# EAGLE design Cyberdeck Mech Keeb (EAGLE 7.7.0)
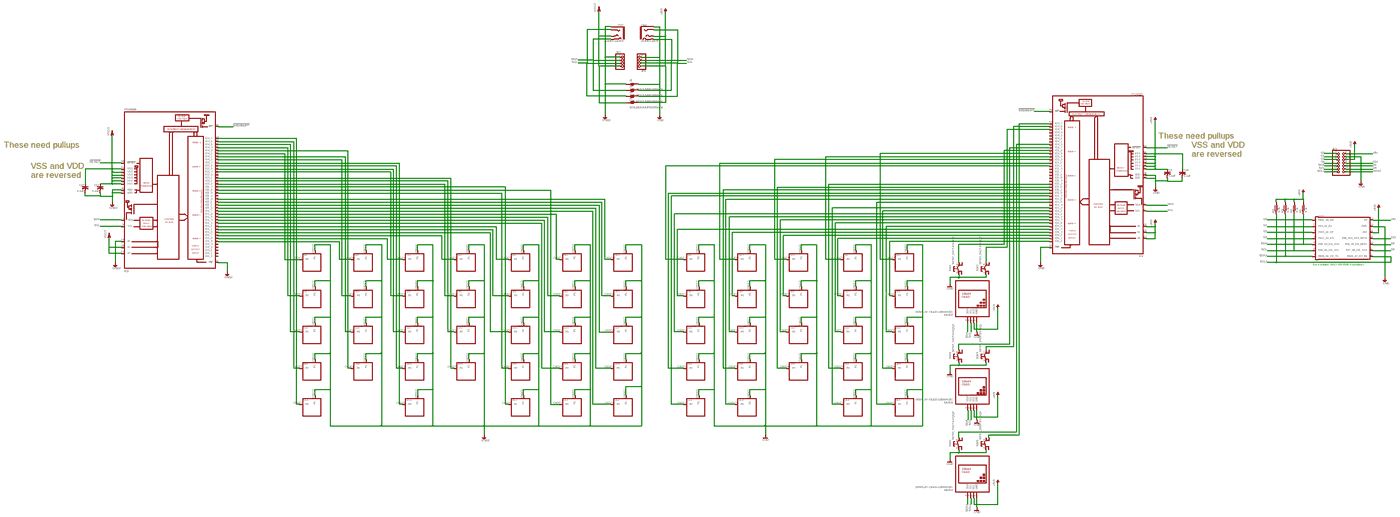
[diagram p0: schematic, sheet 1, overview]
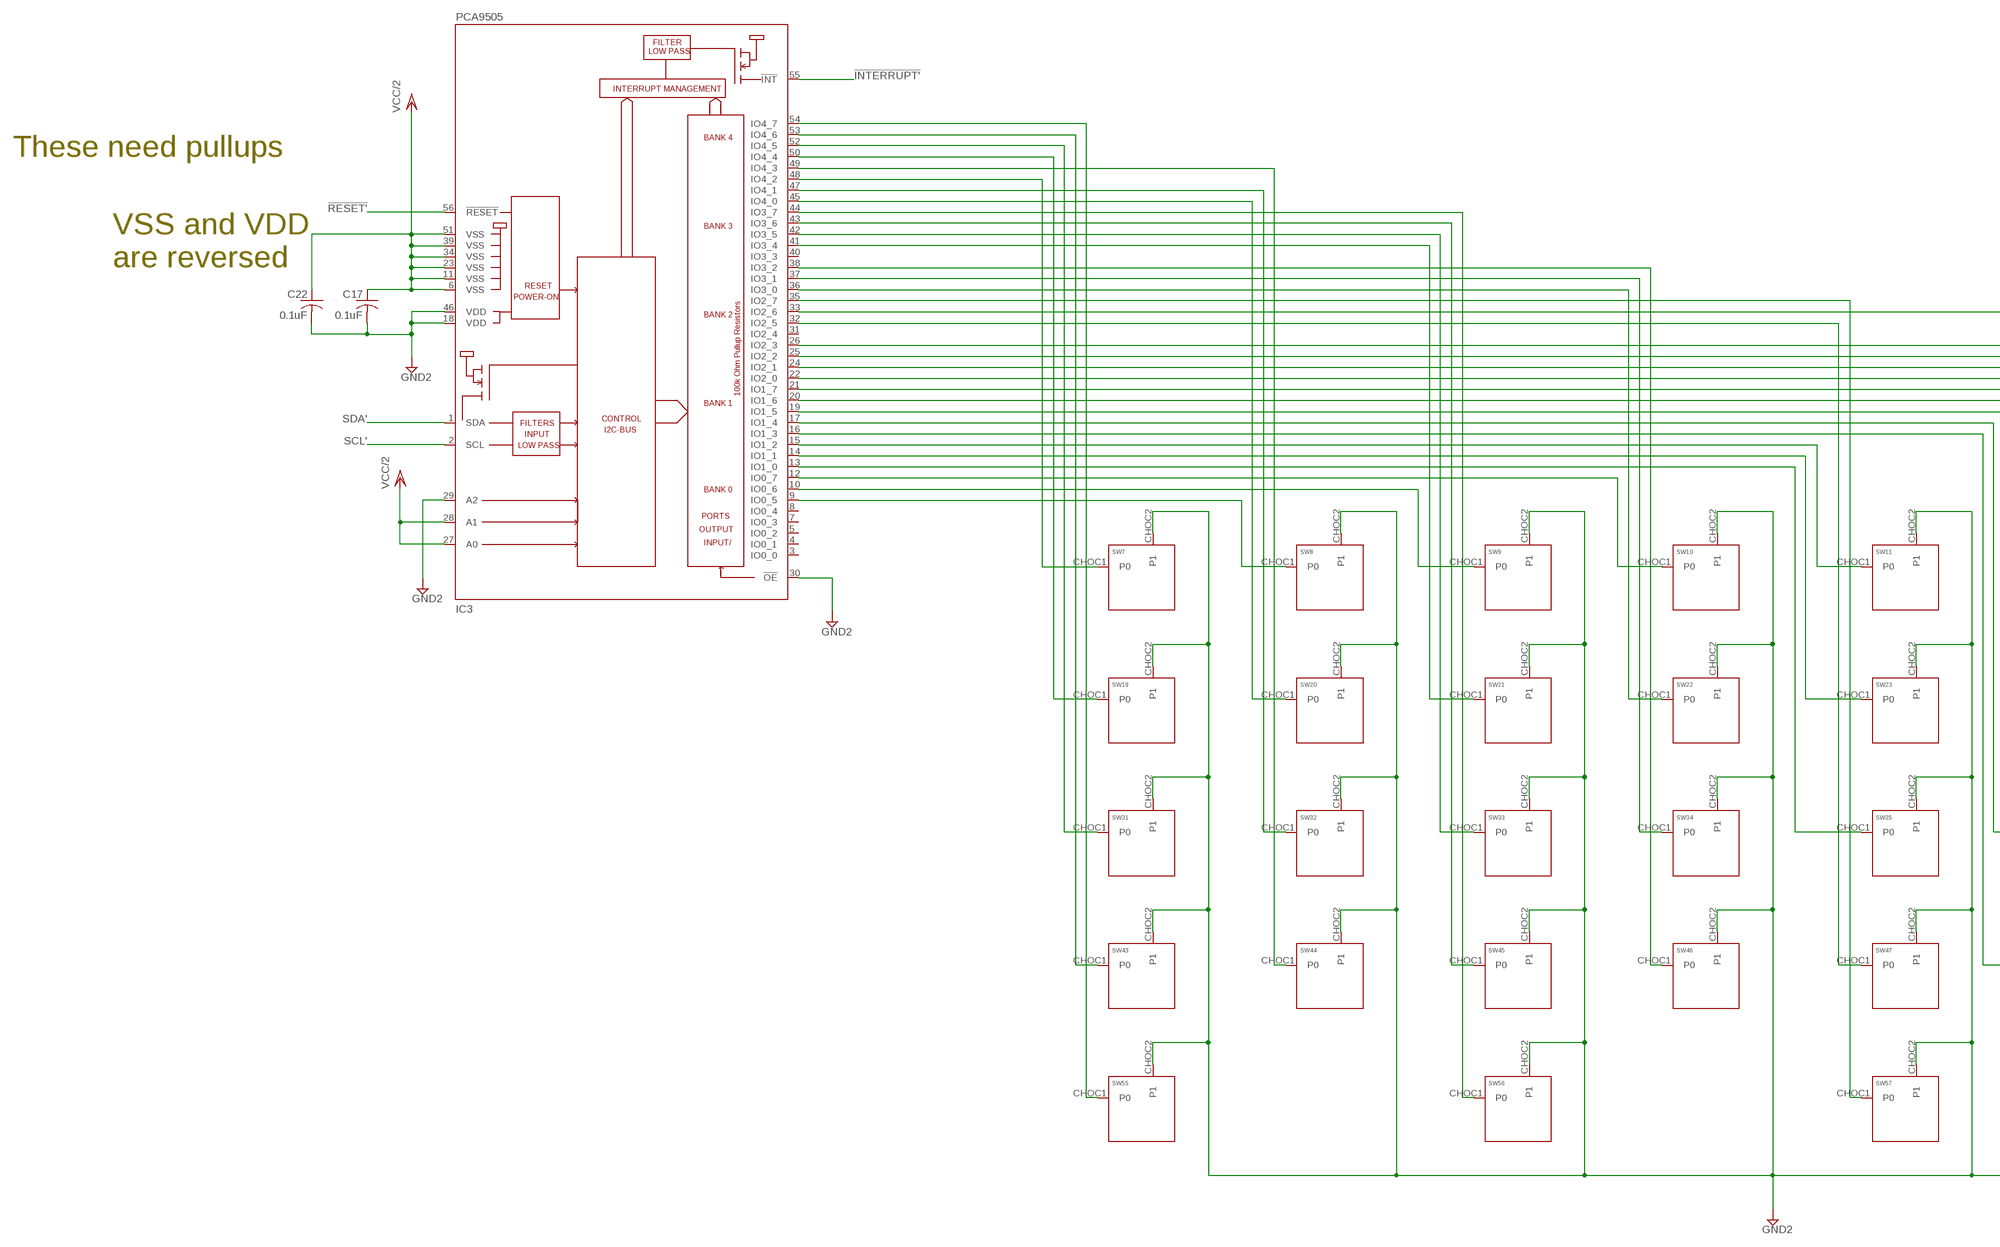
[diagram p1: schematic, sheet 1, part 1 of 4]
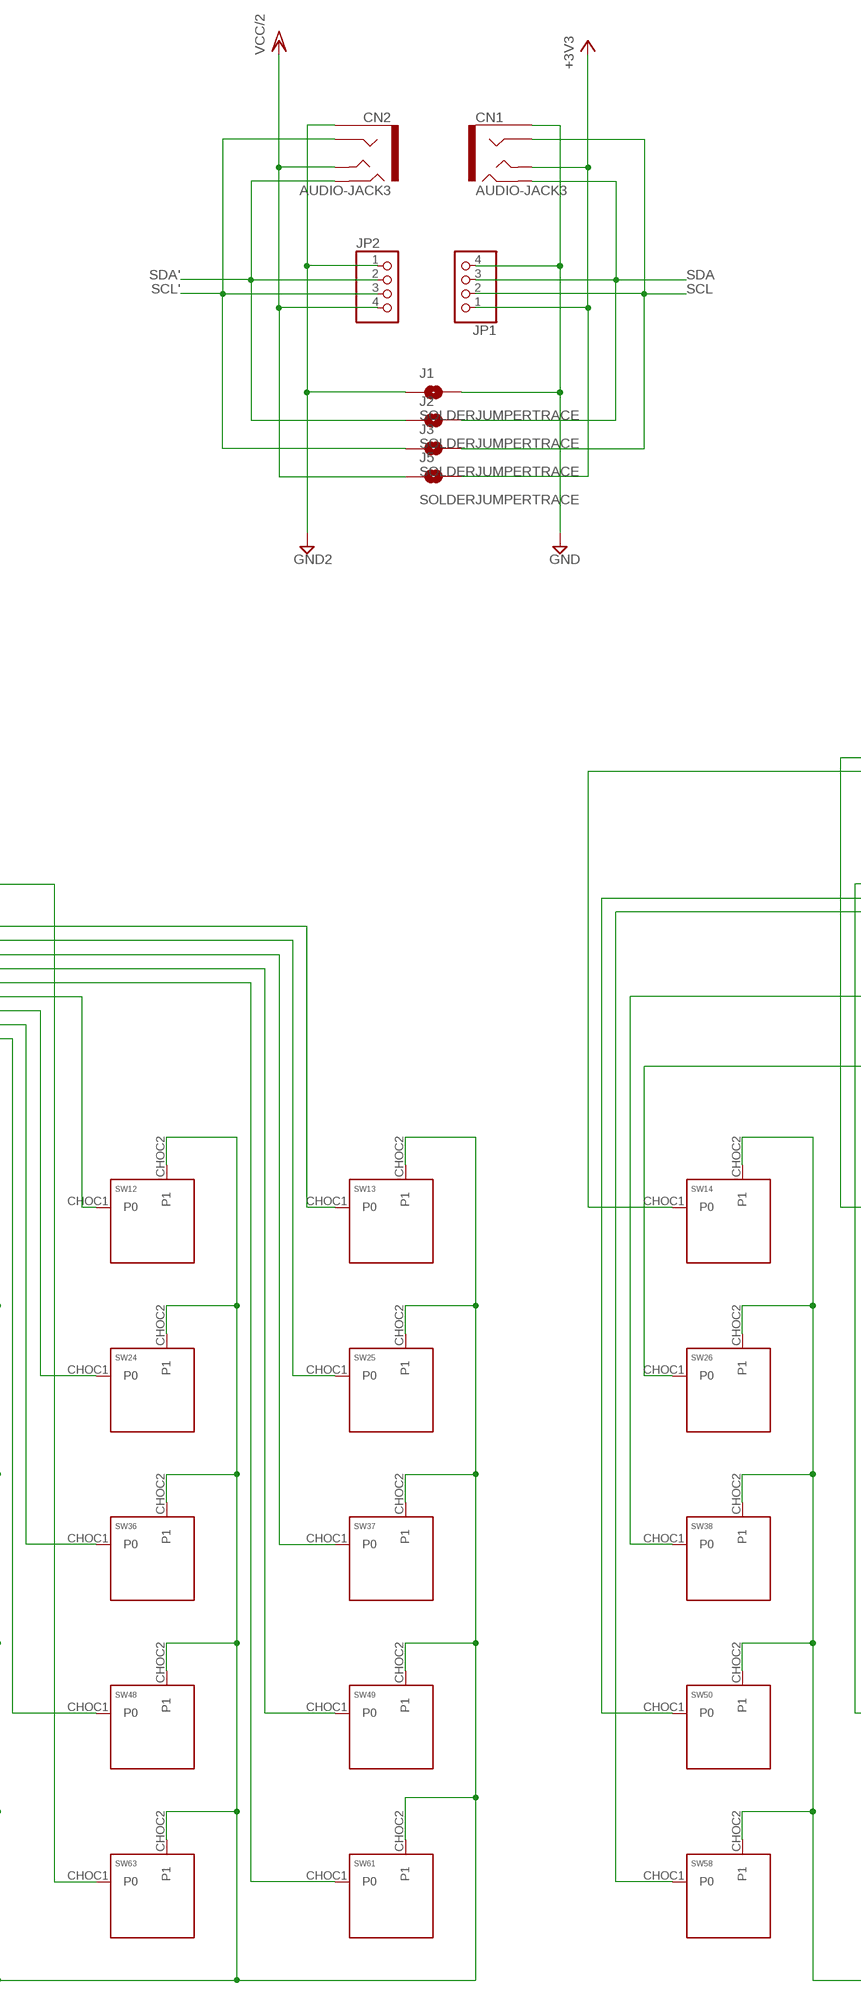
[diagram p2: schematic, sheet 1, part 2 of 4]
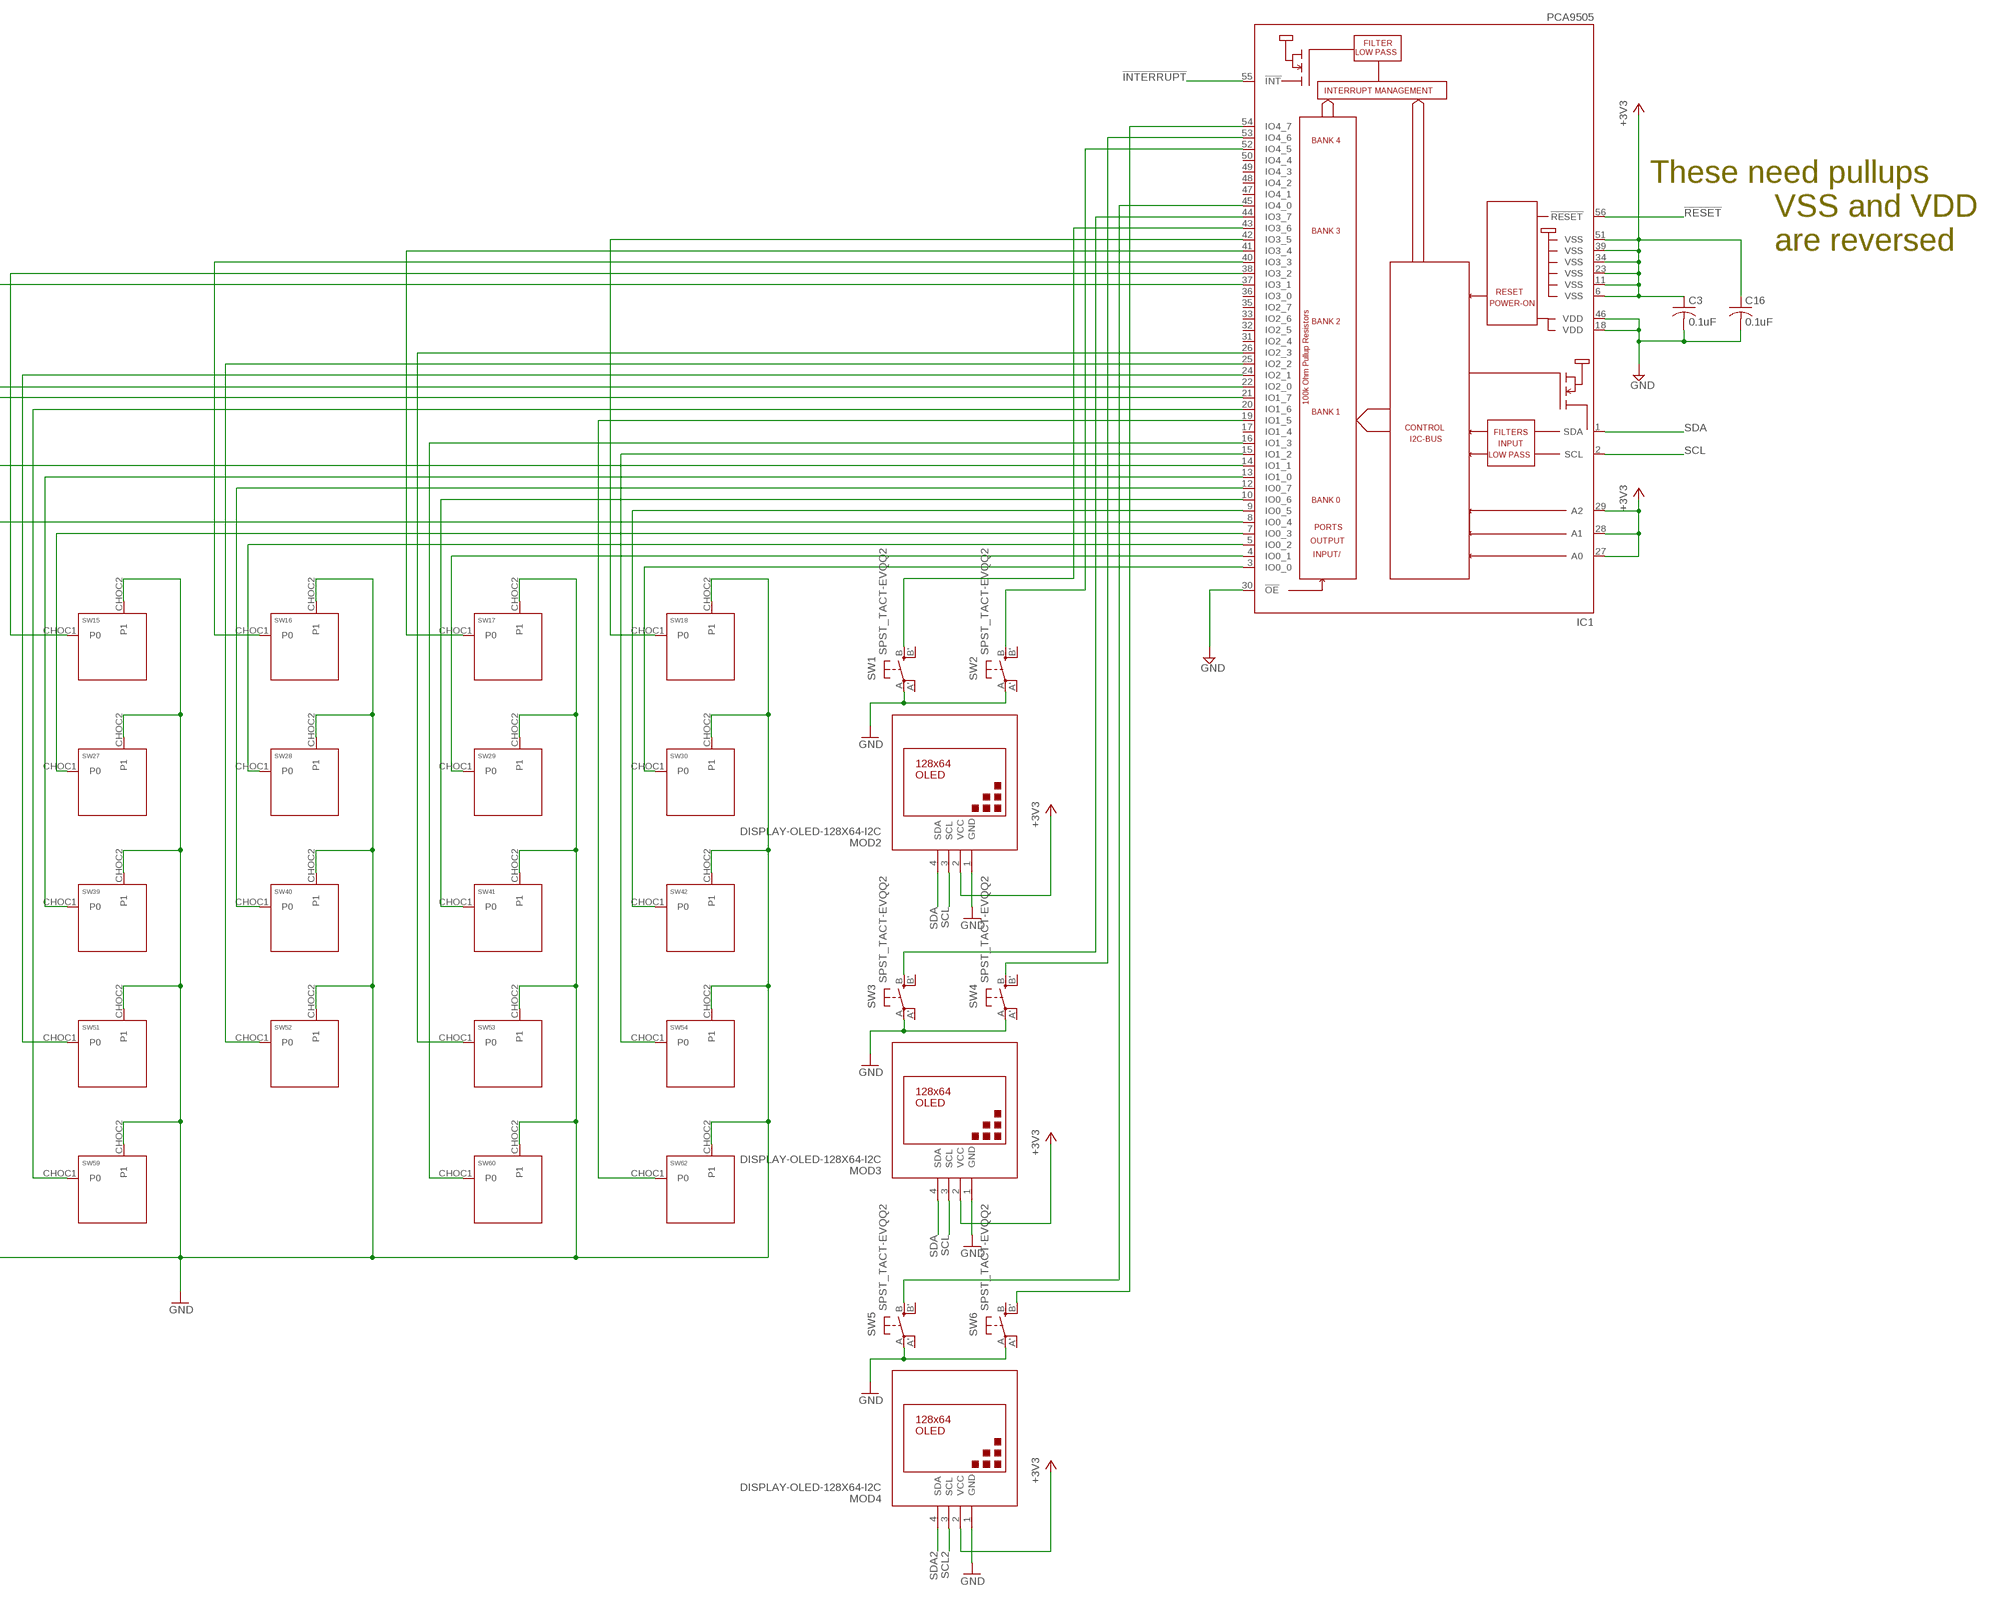
[diagram p3: schematic, sheet 1, part 3 of 4]
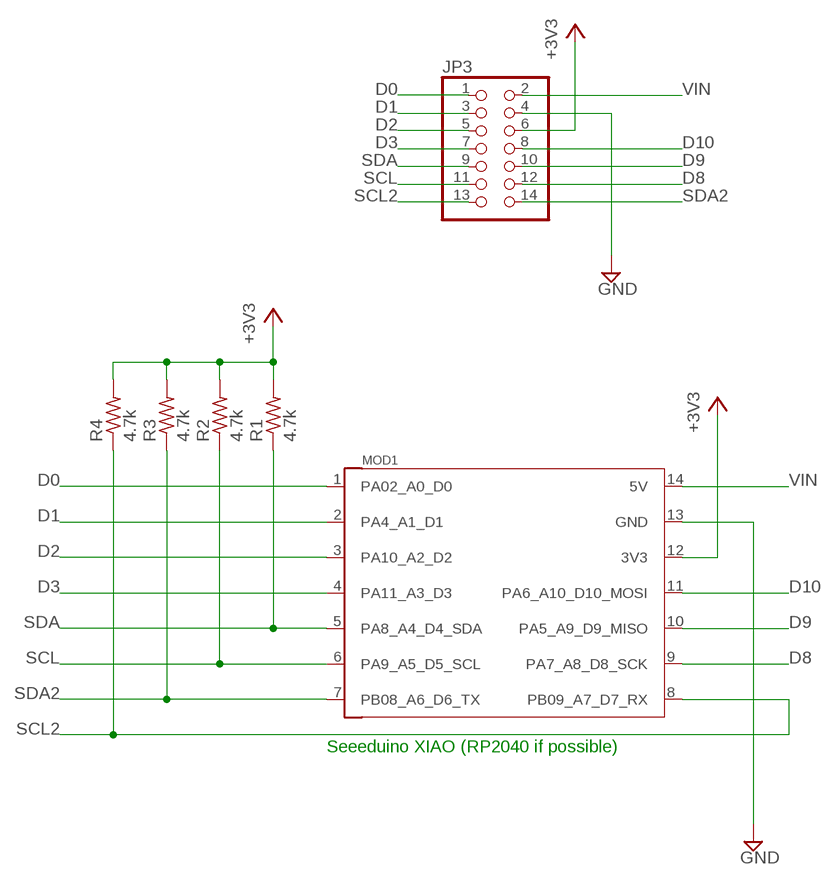
[diagram p4: schematic, sheet 1, part 4 of 4]

## Parts
C3  0.1uF  C-USC0603  [C0603]
C16  0.1uF  C-USC0603  [C0603]
C17  0.1uF  C-USC0603  [C0603]
C22  0.1uF  C-USC0603  [C0603]
CN1  AUDIO-JACK3  [AUDIO-JACK-TRRS-SMD]
CN2  AUDIO-JACK3  [AUDIO-JACK-TRRS-SMD]
IC1  PCA9505  [TSSOP56-6]
IC3  PCA9505  [TSSOP56-6]
J1  SOLDERJUMPERTRACE  [SJ_2S-TRACE]
J2  SOLDERJUMPERTRACE  [SJ_2S-TRACE]
J3  SOLDERJUMPERTRACE  [SJ_2S-TRACE]
J5  SOLDERJUMPERTRACE  [SJ_2S-TRACE]
JP1  PINHD-1X4/90  [1X04/90]
JP2  PINHD-1X4/90  [1X04/90]
JP3  PINHD-2X7  [2X07]
MOD1  MOUDLE-SEEEDUINO-XIAO  [MOUDLE14P-2.54-21X17.8MM]
MOD2  DISPLAY-OLED-128X64-I2C  [DISPLAY-OLED-128X64-I2C]
MOD3  DISPLAY-OLED-128X64-I2C  [DISPLAY-OLED-128X64-I2C]
MOD4  DISPLAY-OLED-128X64-I2C  [DISPLAY-OLED-128X64-I2C]
R1  4.7k  R-US_R0603  [R0603]
R2  4.7k  R-US_R0603  [R0603]
R3  4.7k  R-US_R0603  [R0603]
R4  4.7k  R-US_R0603  [R0603]
SW1  SPST_TACT-EVQQ2  [EVQ-Q2]
SW2  SPST_TACT-EVQQ2  [EVQ-Q2]
SW3  SPST_TACT-EVQQ2  [EVQ-Q2]
SW4  SPST_TACT-EVQQ2  [EVQ-Q2]
SW5  SPST_TACT-EVQQ2  [EVQ-Q2]
SW6  SPST_TACT-EVQQ2  [EVQ-Q2]
SW7  KEYSWITCH-PLAIN-CHOC-1U  [CHOC-1U]
SW8  KEYSWITCH-PLAIN-CHOC-1U  [CHOC-1U]
SW9  KEYSWITCH-PLAIN-CHOC-1U  [CHOC-1U]
SW10  KEYSWITCH-PLAIN-CHOC-1U  [CHOC-1U]
SW11  KEYSWITCH-PLAIN-CHOC-1U  [CHOC-1U]
SW12  KEYSWITCH-PLAIN-CHOC-1U  [CHOC-1U]
SW13  KEYSWITCH-PLAIN-CHOC-1U  [CHOC-1U]
SW14  KEYSWITCH-PLAIN-CHOC-1U  [CHOC-1U]
SW15  KEYSWITCH-PLAIN-CHOC-1U  [CHOC-1U]
SW16  KEYSWITCH-PLAIN-CHOC-1U  [CHOC-1U]
SW17  KEYSWITCH-PLAIN-CHOC-1U  [CHOC-1U]
SW18  KEYSWITCH-PLAIN-CHOC-1U  [CHOC-1U]
SW19  KEYSWITCH-PLAIN-CHOC-1U  [CHOC-1U]
SW20  KEYSWITCH-PLAIN-CHOC-1U  [CHOC-1U]
SW21  KEYSWITCH-PLAIN-CHOC-1U  [CHOC-1U]
SW22  KEYSWITCH-PLAIN-CHOC-1U  [CHOC-1U]
SW23  KEYSWITCH-PLAIN-CHOC-1U  [CHOC-1U]
SW24  KEYSWITCH-PLAIN-CHOC-1U  [CHOC-1U]
SW25  KEYSWITCH-PLAIN-CHOC-1U  [CHOC-1U]
SW26  KEYSWITCH-PLAIN-CHOC-1U  [CHOC-1U]
SW27  KEYSWITCH-PLAIN-CHOC-1U  [CHOC-1U]
SW28  KEYSWITCH-PLAIN-CHOC-1U  [CHOC-1U]
SW29  KEYSWITCH-PLAIN-CHOC-1U  [CHOC-1U]
SW30  KEYSWITCH-PLAIN-CHOC-1U  [CHOC-1U]
SW31  KEYSWITCH-PLAIN-CHOC-1U  [CHOC-1U]
SW32  KEYSWITCH-PLAIN-CHOC-1U  [CHOC-1U]
SW33  KEYSWITCH-PLAIN-CHOC-1U  [CHOC-1U]
SW34  KEYSWITCH-PLAIN-CHOC-1U  [CHOC-1U]
SW35  KEYSWITCH-PLAIN-CHOC-1U  [CHOC-1U]
SW36  KEYSWITCH-PLAIN-CHOC-1U  [CHOC-1U]
SW37  KEYSWITCH-PLAIN-CHOC-1U  [CHOC-1U]
SW38  KEYSWITCH-PLAIN-CHOC-1U  [CHOC-1U]
SW39  KEYSWITCH-PLAIN-CHOC-1U  [CHOC-1U]
SW40  KEYSWITCH-PLAIN-CHOC-1U  [CHOC-1U]
SW41  KEYSWITCH-PLAIN-CHOC-1U  [CHOC-1U]
SW42  KEYSWITCH-PLAIN-CHOC-1U  [CHOC-1U]
SW43  KEYSWITCH-PLAIN-CHOC-1U  [CHOC-1U]
SW44  KEYSWITCH-PLAIN-CHOC-1U  [CHOC-1U]
SW45  KEYSWITCH-PLAIN-CHOC-1U  [CHOC-1U]
SW46  KEYSWITCH-PLAIN-CHOC-1U  [CHOC-1U]
SW47  KEYSWITCH-PLAIN-CHOC-1U  [CHOC-1U]
SW48  KEYSWITCH-PLAIN-CHOC-1U  [CHOC-1U]
SW49  KEYSWITCH-PLAIN-CHOC-1U  [CHOC-1U]
SW50  KEYSWITCH-PLAIN-CHOC-1U  [CHOC-1U]
SW51  KEYSWITCH-PLAIN-CHOC-1U  [CHOC-1U]
SW52  KEYSWITCH-PLAIN-CHOC-1U  [CHOC-1U]
SW53  KEYSWITCH-PLAIN-CHOC-1U  [CHOC-1U]
SW54  KEYSWITCH-PLAIN-CHOC-1U  [CHOC-1U]
SW55  KEYSWITCH-PLAIN-CHOC-1U  [CHOC-1U]
SW56  KEYSWITCH-PLAIN-CHOC-1U  [CHOC-1U]
SW57  KEYSWITCH-PLAIN-CHOC-1U  [CHOC-1U]
SW58  KEYSWITCH-PLAIN-CHOC-1U  [CHOC-1U]
SW59  KEYSWITCH-PLAIN-CHOC-1U  [CHOC-1U]
SW60  KEYSWITCH-PLAIN-CHOC-1U  [CHOC-1U]
SW61  KEYSWITCH-PLAIN-CHOC-1U  [CHOC-1U]
SW62  KEYSWITCH-PLAIN-CHOC-1U  [CHOC-1U]
SW63  KEYSWITCH-PLAIN-CHOC-1U  [CHOC-1U]

## Nets
!INTERRUPT: IC1.55(!INT)
!INTERRUPT': IC3.55(!INT)
!RESET: IC1.56(!RESET)
!RESET': IC3.56(!RESET)
+3V3: C3.1 C16.1 CN1.TIP IC1.6(VSS) IC1.11(VSS) IC1.23(VSS) IC1.27(A0) IC1.28(A1) IC1.29(A2) IC1.34(VSS) IC1.39(VSS) IC1.51(VSS) J5.2 JP1.1 JP3.6 MOD1.12(3V3) MOD2.2(VCC) MOD3.2(VCC) MOD4.2(VCC) R1.2 R2.2 R3.2 R4.2
BAR: IC1.4(IO0_1) SW29.CHOC1(P0)
D0: JP3.1 MOD1.1(PA02_A0_D0)
D1: JP3.3 MOD1.2(PA4_A1_D1)
D2: JP3.5 MOD1.3(PA10_A2_D2)
D3: JP3.7 MOD1.4(PA11_A3_D3)
D8: JP3.12 MOD1.9(PA7_A8_D8_SCK)
D9: JP3.10 MOD1.10(PA5_A9_D9_MISO)
D10: JP3.8 MOD1.11(PA6_A10_D10_MOSI)
GND: C3.2 C16.2 CN1.EARTH IC1.18(VDD) IC1.30(!OE) IC1.46(VDD) J1.2 JP1.4 JP3.4 MOD1.13(GND) MOD2.1(GND) MOD3.1(GND) MOD4.1(GND) SW1.A(P) SW2.A(P) SW3.A(P) SW4.A(P) SW5.A(P) SW6.A(P) SW14.CHOC2(P1) SW15.CHOC2(P1) SW16.CHOC2(P1) SW17.CHOC2(P1) SW18.CHOC2(P1) SW26.CHOC2(P1) SW27.CHOC2(P1) SW28.CHOC2(P1) SW29.CHOC2(P1) SW30.CHOC2(P1) SW38.CHOC2(P1) SW39.CHOC2(P1) SW40.CHOC2(P1) SW41.CHOC2(P1) SW42.CHOC2(P1) SW50.CHOC2(P1) SW51.CHOC2(P1) SW52.CHOC2(P1) SW53.CHOC2(P1) SW54.CHOC2(P1) SW58.CHOC2(P1) SW59.CHOC2(P1) SW60.CHOC2(P1) SW62.CHOC2(P1)
GND2: C17.2 C22.2 CN2.EARTH IC3.18(VDD) IC3.29(A2) IC3.30(!OE) IC3.46(VDD) J1.1 JP2.1 SW7.CHOC2(P1) SW8.CHOC2(P1) SW9.CHOC2(P1) SW10.CHOC2(P1) SW11.CHOC2(P1) SW12.CHOC2(P1) SW13.CHOC2(P1) SW19.CHOC2(P1) SW20.CHOC2(P1) SW21.CHOC2(P1) SW22.CHOC2(P1) SW23.CHOC2(P1) SW24.CHOC2(P1) SW25.CHOC2(P1) SW31.CHOC2(P1) SW32.CHOC2(P1) SW33.CHOC2(P1) SW34.CHOC2(P1) SW35.CHOC2(P1) SW36.CHOC2(P1) SW37.CHOC2(P1) SW43.CHOC2(P1) SW44.CHOC2(P1) SW45.CHOC2(P1) SW46.CHOC2(P1) SW47.CHOC2(P1) SW48.CHOC2(P1) SW49.CHOC2(P1) SW55.CHOC2(P1) SW56.CHOC2(P1) SW57.CHOC2(P1) SW61.CHOC2(P1) SW63.CHOC2(P1)
N$1: IC1.53(IO4_6) SW4.B(S)
N$2: IC3.48(IO4_2) SW7.CHOC1(P0)
N$3: IC1.45(IO4_0) SW5.B(S)
N$4: IC3.9(IO0_5) SW8.CHOC1(P0)
N$5: IC1.52(IO4_5) SW2.B(S)
N$6: IC3.10(IO0_6) SW9.CHOC1(P0)
N$7: IC1.7(IO0_3) SW27.CHOC1(P0)
N$8: IC3.12(IO0_7) SW10.CHOC1(P0)
N$9: IC3.25(IO2_2) SW25.CHOC1(P0)
N$10: IC1.21(IO1_7) SW58.CHOC1(P0)
N$11: IC1.42(IO3_5) SW18.CHOC1(P0)
N$12: IC3.47(IO4_1) SW32.CHOC1(P0)
N$13: IC3.22(IO2_0) SW49.CHOC1(P0)
N$14: IC3.49(IO4_3) SW44.CHOC1(P0)
N$15: IC1.8(IO0_4) SW26.CHOC1(P0)
N$16: IC1.37(IO3_1) SW14.CHOC1(P0)
N$17: IC1.3(IO0_0) SW30.CHOC1(P0)
N$19: IC3.35(IO2_7) SW57.CHOC1(P0)
N$20: IC3.20(IO1_6) SW12.CHOC1(P0)
N$21: IC3.44(IO3_7) SW56.CHOC1(P0)
N$22: IC1.15(IO1_2) SW54.CHOC1(P0)
N$23: IC3.54(IO4_7) SW55.CHOC1(P0)
N$24: IC1.9(IO0_5) SW42.CHOC1(P0)
N$25: IC3.19(IO1_5) SW24.CHOC1(P0)
N$26: IC3.50(IO4_4) SW19.CHOC1(P0)
N$27: IC1.43(IO3_6) SW1.B(S)
N$28: IC3.45(IO4_0) SW20.CHOC1(P0)
N$29: IC1.13(IO1_0) SW39.CHOC1(P0)
N$30: IC3.41(IO3_4) SW21.CHOC1(P0)
N$31: IC1.19(IO1_5) SW62.CHOC1(P0)
N$32: IC3.36(IO3_0) SW22.CHOC1(P0)
N$33: IC1.12(IO0_7) SW40.CHOC1(P0)
N$34: IC3.26(IO2_3) SW13.CHOC1(P0)
N$35: IC3.17(IO1_4) SW36.CHOC1(P0)
N$36: IC3.13(IO1_0) SW35.CHOC1(P0)
N$37: IC1.16(IO1_3) SW60.CHOC1(P0)
N$38: IC3.16(IO1_3) SW48.CHOC1(P0)
N$39: IC1.20(IO1_6) SW59.CHOC1(P0)
N$40: IC1.14(IO1_1) SW38.CHOC1(P0)
N$41: IC1.5(IO0_2) SW28.CHOC1(P0)
N$43: IC3.14(IO1_1) SW23.CHOC1(P0)
N$44: IC3.15(IO1_2) SW11.CHOC1(P0)
N$46: IC1.54(IO4_7) SW6.B'(S1)
N$47: IC1.41(IO3_4) SW17.CHOC1(P0)
N$48: IC1.22(IO2_0) SW50.CHOC1(P0)
N$49: IC1.24(IO2_1) SW51.CHOC1(P0)
N$50: IC3.52(IO4_5) SW31.CHOC1(P0)
N$51: IC1.25(IO2_2) SW52.CHOC1(P0)
N$52: IC1.44(IO3_7) SW3.B(S)
N$53: IC1.26(IO2_3) SW53.CHOC1(P0)
N$54: IC3.42(IO3_5) SW33.CHOC1(P0)
N$55: IC1.40(IO3_3) SW16.CHOC1(P0)
N$56: IC3.37(IO3_1) SW34.CHOC1(P0)
N$57: IC3.33(IO2_6) SW63.CHOC1(P0)
N$63: IC1.38(IO3_2) SW15.CHOC1(P0)
N$64: IC1.10(IO0_6) SW41.CHOC1(P0)
N$74: IC3.53(IO4_6) SW43.CHOC1(P0)
N$75: IC3.24(IO2_1) SW37.CHOC1(P0)
N$78: IC3.43(IO3_6) SW45.CHOC1(P0)
N$80: IC3.38(IO3_2) SW46.CHOC1(P0)
N$82: IC3.32(IO2_5) SW47.CHOC1(P0)
N$86: IC3.21(IO1_7) SW61.CHOC1(P0)
SCL: CN1.RING1 IC1.2(SCL) J3.2 JP1.2 JP3.11 MOD1.6(PA9_A5_D5_SCL) MOD2.3(SCL) MOD3.3(SCL) R2.1
SCL2: JP3.13 MOD1.8(PB09_A7_D7_RX) MOD4.3(SCL) R4.1
SCL': CN2.RING1 IC3.2(SCL) J3.1 JP2.3
SDA: CN1.RING2 IC1.1(SDA) J2.2 JP1.3 JP3.9 MOD1.5(PA8_A4_D4_SDA) MOD2.4(SDA) MOD3.4(SDA) R1.1
SDA2: JP3.14 MOD1.7(PB08_A6_D6_TX) MOD4.4(SDA) R3.1
SDA': CN2.RING2 IC3.1(SDA) J2.1 JP2.2
VCC/2: C17.1 C22.1 CN2.TIP IC3.6(VSS) IC3.11(VSS) IC3.23(VSS) IC3.27(A0) IC3.28(A1) IC3.34(VSS) IC3.39(VSS) IC3.51(VSS) J5.1 JP2.4
VIN: JP3.2 MOD1.14(5V)
Unconnected: IC1.17(IO1_4) IC1.31(IO2_4) IC1.32(IO2_5) IC1.33(IO2_6) IC1.35(IO2_7) IC1.36(IO3_0) IC1.47(IO4_1) IC1.48(IO4_2) IC1.49(IO4_3) IC1.50(IO4_4) IC3.3(IO0_0) IC3.4(IO0_1) IC3.5(IO0_2) IC3.7(IO0_3) IC3.8(IO0_4) IC3.31(IO2_4) IC3.40(IO3_3) SW1.A'(P1) SW1.B'(S1) SW2.A'(P1) SW2.B'(S1) SW3.A'(P1) SW3.B'(S1) SW4.A'(P1) SW4.B'(S1) SW5.A'(P1) SW5.B'(S1) SW6.A'(P1) SW6.B(S)

## Notes on the sheet
- These need pullups
- These need pullups
- VSS and VDD
  are reversed
- VSS and VDD
  are reversed
- Seeeduino XIAO (RP2040 if possible)

## Library data of the parts
C3 C16 C17 C22 = rcl:C-US: CAPACITOR, American symbol
CN1 CN2 = SparkFun-Connectors:AUDIO-JACK3: Audio jack - 3.5mm TRRS variety - two rings.
IC1 IC3 = micro-philips:PCA9505: 40-bit I2C-bus I/O port with /RESET, /OE and /INT The 9505 has 100k ohm pull-ups on IO pins. Source: http://www.nxp.com/acrobat_download/datasheets/PCA9505_9506_3.pdf; MPN: PCA9505DGG,118; OC_FARNELL: unknown; OC_NEWARK: 70R6450
J1-J3 J5 = SparkFun-Passives:SOLDERJUMPER: Solder Jumper Standard SMD solder jumper. Used to automate production. Two varients : Normally Open and Normally Closed are the same, but have different paste layers. NC will have a large amount of paste and should jumper during reflow.
JP1 JP2 = pinhead:PINHD-1X4: PIN HEADER
JP3 = pinhead:PINHD-2X7: PIN HEADER
MOD1 = Seeeduino XIAO:MOUDLE-SEEEDUINO-XIAO
MOD2-MOD4 = diy-modules:DISPLAY-OLED-128X64-I2C: 128x64 Dot Matrix OLED Module based on SSD1306 chip Variant with I2C interface More details available here: http://www.instructables.com/id/Monochrome-096-i2c-OLED-display-with-arduino-SSD13/ SSD1306 datasheet: https://cdn-shop.adafruit.com/datasheets/SSD1306.pdf Click here to find device on ebay.com <http://www.ebay.com/sch/oled+display+128x64+iic> Note: There are two variants: I2C and SPI. Search for the proper version.
R1-R4 = rcl:R-US_: RESISTOR, American symbol
SW1-SW6 = adafruit:SPST_TACT: SMT 6mm switch, EVQQ2 series http://www.ladyada.net/library/eagle
SW7-SW63 = Keyboard:KEYSWITCH-PLAIN

## Board
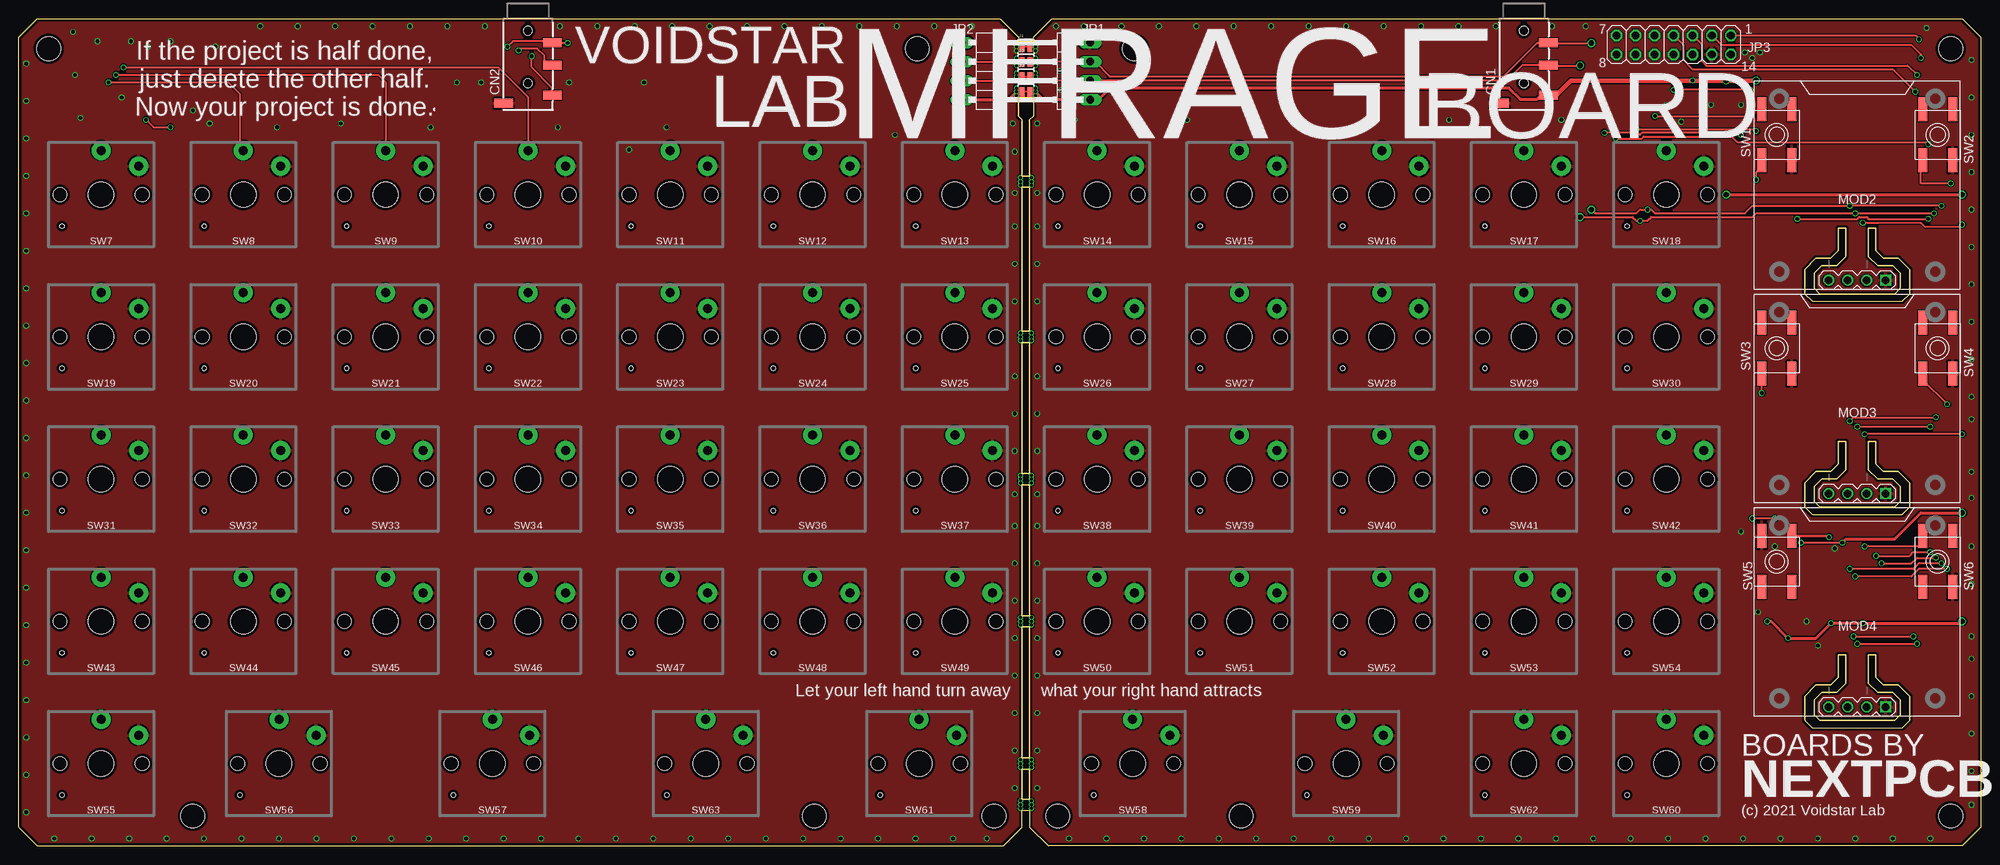
[diagram p5: board, top side]
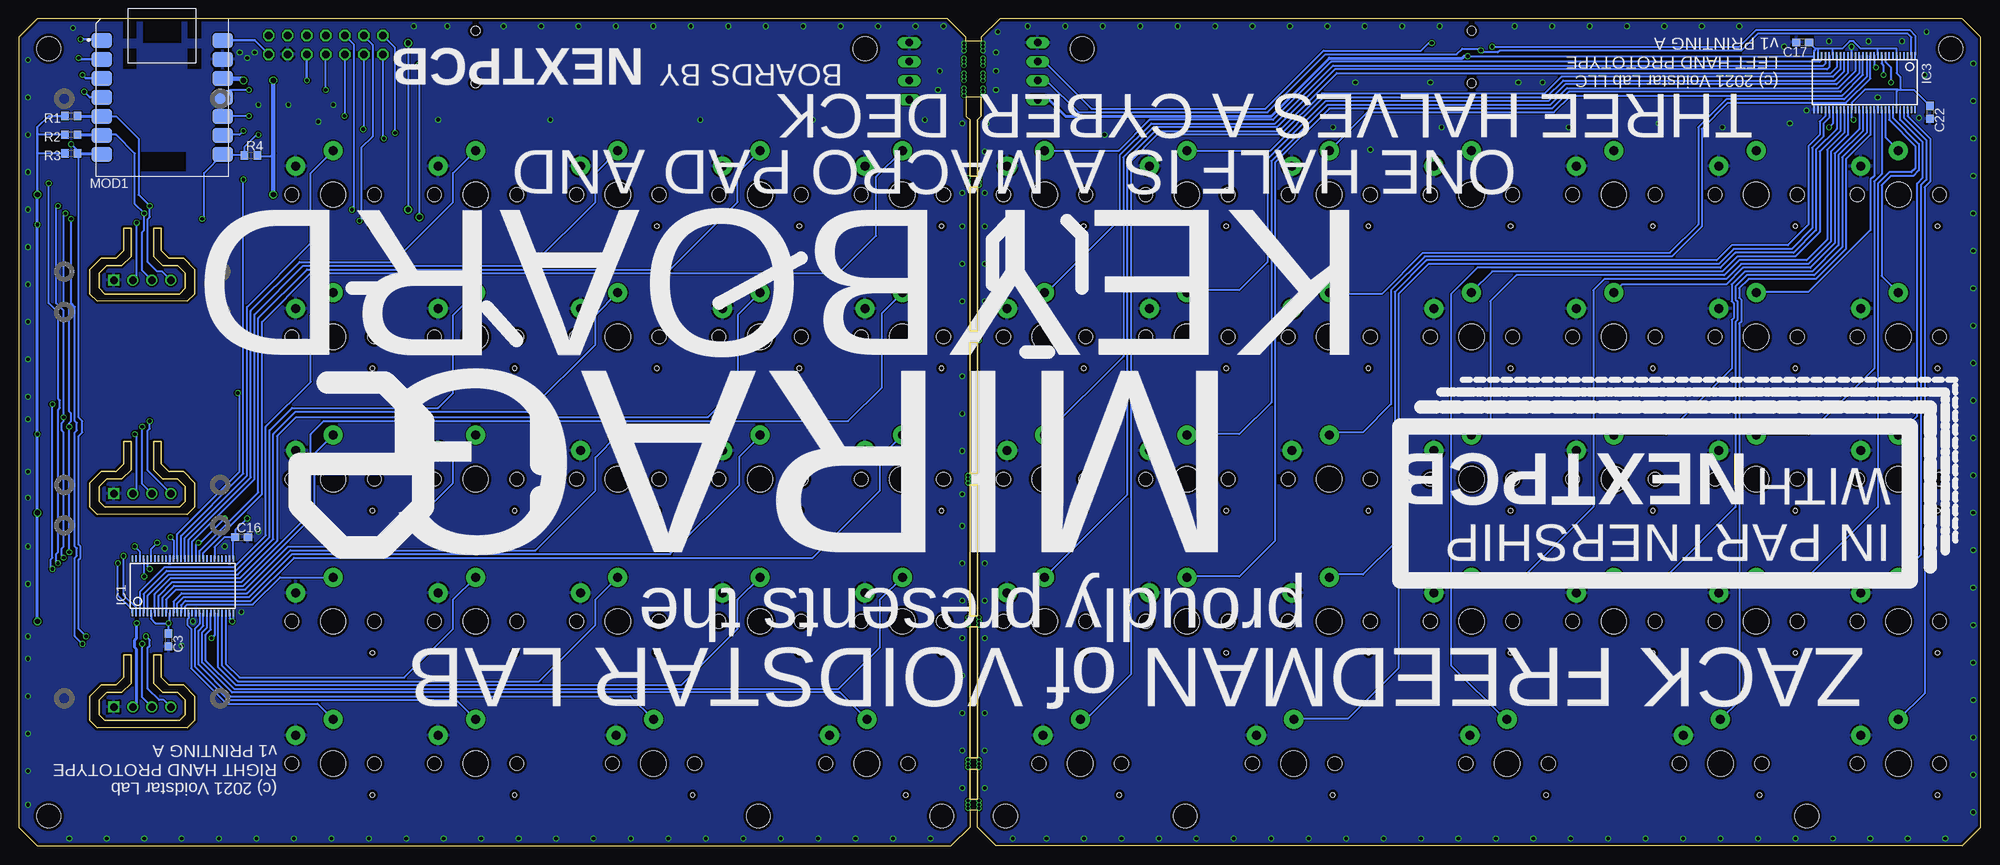
[diagram p6: board, bottom side, seen from below]

Size 262 x 110.5 mm. Coordinates in mm from the lower left corner, seen from the top.
Outline: 135,4.75 135,2.5 137.5,0 259.5,0 262,2.5 262,108 259.5,110.5 138,110.5 135.5,108 135.5,107.5 133.5,107.5 133.5,108 131,110.5 2.5,110.5 0,108 0,2.5 2.5,0 131.5,0 134,2.5 134,4.75 135,4.75
Outline: 135,11.75 135,29.25 134,29.25 134,11.75 135,11.75
Outline: 133.5,100 135.5,100 135.5,97.5 135,97 135,89.5 134,89.5 134,97 133.5,97.5 133.5,100
Outline: 135,88 134,88 134,68.75 135,68.75 135,88
Outline: 135,67.25 134,67.25 134,49.75 135,49.75 135,67.25
Outline: 135,48.25 134,48.25 134,30.75 135,30.75 135,48.25
Outline: 134,6.25 135,6.25 135,10.25 134,10.25 134,6.25
Outline: 243,82.5 244,82.5 244,78.75 242.75,77.5 240.75,77.5 239.75,76.5 239.75,74.5 240.5,73.75 250.5,73.75 251.25,74.5 251.25,76.5 250.25,77.5 248.25,77.5 247,78.75 247,82.5 248,82.5 248,79.5 249,78.5 251,78.5 252.5,77 252.5,73.75 251.5,72.75 239.5,72.75 238.5,73.75 238.5,77 240,78.5 242,78.5 243,79.5 243,82.5
Outline: 243,54 244,54 244,50.25 242.75,49 240.75,49 239.75,48 239.75,46 240.5,45.25 250.5,45.25 251.25,46 251.25,48 250.25,49 248.25,49 247,50.25 247,54 248,54 248,51 249,50 251,50 252.5,48.5 252.5,45.25 251.5,44.25 239.5,44.25 238.5,45.25 238.5,48.5 240,50 242,50 243,51 243,54
Outline: 243,25.5 244,25.5 244,21.75 242.75,20.5 240.75,20.5 239.75,19.5 239.75,17.5 240.5,16.75 250.5,16.75 251.25,17.5 251.25,19.5 250.25,20.5 248.25,20.5 247,21.75 247,25.5 248,25.5 248,22.5 249,21.5 251,21.5 252.5,20 252.5,16.75 251.5,15.75 239.5,15.75 238.5,16.75 238.5,20 240,21.5 242,21.5 243,22.5 243,25.5
Copper layers (1*16): Top 0.035559375mm / dielectric 1.6mm / Bottom 0.035559375mm
Design rules "oshpark-2layer *": minimum track width 6mil, minimum drill 10mil, track to track 6mil, track to pad 6mil, pad to pad 6mil, via to via 6mil, smd to smd 6mil, copper to edge 15mil, drill to drill 6mil, minimum pad ring 5mil, minimum via ring 5mil, stop-mask expansion 2.5mil, vias tented up to drill 0mil, thermal gap 10mil
Holes 3.2 mm at 258,4 23.25,4 4,106.5 258,106.5 163.25,4 106.25,4 149,106.5 120,106.5 138.75,4 130.25,4
Milling: area 238.5,15.8 to 252.5,25.5; area 238.5,44.2 to 252.5,54; area 238.5,72.8 to 252.5,82.5; area 133.5,89.5 to 135.5,100; area 134,68.8 to 135,88; area 134,49.8 to 135,67.2; area 134,30.8 to 135,48.2; area 134,11.8 to 135,29.2; area 134,6.2 to 135,10.2

### Footprints (pad centres in the part's own frame; a part is rotated, then mirrored left to right if it is on the bottom)
C0603 = smd 1.1 x 1: 1 -0.85,0; 2 0.85,0
AUDIO-JACK-TRRS-SMD = smd 1.2 x 2.5: EARTH 11.3,-3.25; RING1 6.2,3.25; RING2 3.2,3.25; TIP 10.2,3.25 | hole 1.2: 1.6,0; 8.6,0
TSSOP56-6 = smd 0.2 x 0.9: 1 -6.75,-3.6; 2 -6.25,-3.6; 3 -5.75,-3.6; 4 -5.25,-3.6; 5 -4.75,-3.6; 6 -4.25,-3.6; 7 -3.75,-3.6; 8 -3.25,-3.6; 9 -2.75,-3.6; 10 -2.25,-3.6; 11 -1.75,-3.6; 12 -1.25,-3.6; 13 -0.75,-3.6; 14 -0.25,-3.6; 15 0.25,-3.6; 16 0.75,-3.6; 17 1.25,-3.6; 18 1.75,-3.6; 19 2.25,-3.6; 20 2.75,-3.6; 21 3.25,-3.6; 22 3.75,-3.6; 23 4.25,-3.6; 24 4.75,-3.6; 25 5.25,-3.6; 26 5.75,-3.6; 27 6.25,-3.6; 28 6.75,-3.6; 29 6.75,3.66; 30 6.25,3.66; 31 5.75,3.66; 32 5.25,3.66; 33 4.75,3.66; 34 4.25,3.66; 35 3.75,3.66; 36 3.25,3.66; 37 2.75,3.66; 38 2.25,3.66; 39 1.75,3.66; 40 1.25,3.66; 41 0.75,3.66; 42 0.25,3.66; 43 -0.25,3.66; 44 -0.75,3.66; 45 -1.25,3.66; 46 -1.75,3.66; 47 -2.25,3.66; 48 -2.75,3.66; 49 -3.25,3.66; 50 -3.75,3.66; 51 -4.25,3.66; 52 -4.75,3.66; 53 -5.25,3.66; 54 -5.75,3.66; 55 -6.25,3.66; 56 -6.75,3.66
SJ_2S-TRACE = smd 0.635 x 1.27: 1 -0.508,0; 2 0.508,0
1X04/90 = drill 1.016 long: 1 -3.81,-3.81; 2 -1.27,-3.81; 3 1.27,-3.81; 4 3.81,-3.81
2X07 = drill 1.016 octagon: 1 -7.62,-1.27; 2 -7.62,1.27; 3 -5.08,-1.27; 4 -5.08,1.27; 5 -2.54,-1.27; 6 -2.54,1.27; 7 0,-1.27; 8 0,1.27; 9 2.54,-1.27; 10 2.54,1.27; 11 5.08,-1.27; 12 5.08,1.27; 13 7.62,-1.27; 14 7.62,1.27
MOUDLE14P-2.54-21X17.8MM = smd 2.75 x 2: 1 0.835,18.12; 2 0.835,15.58; 3 0.835,13.04; 4 0.835,10.5; 5 0.835,7.96; 6 0.835,5.42; 7 0.835,2.88; 8 17,2.88; 9 17,5.42; 10 17,7.96; 11 17,10.5; 12 17,13.04; 13 17,15.58; 14 17,18.12
DISPLAY-OLED-128X64-I2C = drill 1 square: 1 -3.81,11.43 | drill 1: 2 -1.27,11.43; 3 1.27,11.43; 4 3.81,11.43
R0603 = smd 1 x 1.1: 1 -0.85,0; 2 0.85,0
EVQ-Q2 = smd 3.2 x 1.2: A -3.4,-2; A' 3.4,-2; B -3.4,2; B' 3.4,2
CHOC-1U = drill 1.2 pad 2.54: CHOC1 0,5.9; CHOC2 5,3.8 | hole 3.4: 0,0 | hole 0.6: -5.22,-4.2 | hole 1.85: -5.5,0; 5.5,0

### Placement (x,y rotation side)
C3  242,27.5 270 bottom
C16  232.25,41.25 0 bottom
C17  23.78,107.35 180 bottom
C22  6.79,98 270 bottom
CN1  201,110.5 270 top
CN2  68,110.5 270 top
IC1  240.09,34.71 0 bottom
IC3  15.5,102 180 bottom
J1  134.5,106.75 0 top
J2  134.5,104.75 0 top
J3  134.5,102.75 0 top
J5  134.5,100.75 0 top
JP1  139.25,103.5 90 top
JP2  129.75,103.5 270 top
JP3  221,107 180 top
MOD1  251.75,89.5 0 bottom
MOD2  245.5,87 180 top
MOD3  245.5,58.5 180 top
MOD4  245.5,30 180 top
R1  255,97.5 180 bottom
R2  255,95 180 bottom
R3  255,92.5 180 bottom
R4  231,92.25 0 bottom
SW1  234.75,95 90 top
SW2  256.25,95 90 top
SW3  234.75,66.5 90 top
SW4  256.25,66.5 90 top
SW5  234.75,38 270 top
SW6  256.25,38 90 top
SW7  11,87 0 top
SW8  30,87 0 top
SW9  49,87 0 top
SW10  68,87 0 top
SW11  87,87 0 top
SW12  106,87 0 top
SW13  125,87 0 top
SW14  144,87 0 top
SW15  163,87 0 top
SW16  182,87 0 top
SW17  201,87 0 top
SW18  220,87 0 top
SW19  11,68 0 top
SW20  30,68 0 top
SW21  49,68 0 top
SW22  68,68 0 top
SW23  87,68 0 top
SW24  106,68 0 top
SW25  125,68 0 top
SW26  144,68 0 top
SW27  163,68 0 top
SW28  182,68 0 top
SW29  201,68 0 top
SW30  220,68 0 top
SW31  11,49 0 top
SW32  30,49 0 top
SW33  49,49 0 top
SW34  68,49 0 top
SW35  87,49 0 top
SW36  106,49 0 top
SW37  125,49 0 top
SW38  144,49 0 top
SW39  163,49 0 top
SW40  182,49 0 top
SW41  201,49 0 top
SW42  220,49 0 top
SW43  11,30 0 top
SW44  30,30 0 top
SW45  49,30 0 top
SW46  68,30 0 top
SW47  87,30 0 top
SW48  106,30 0 top
SW49  125,30 0 top
SW50  144,30 0 top
SW51  163,30 0 top
SW52  182,30 0 top
SW53  201,30 0 top
SW54  220,30 0 top
SW55  11,11 0 top
SW56  34.75,11 0 top
SW57  63.25,11 0 top
SW58  148.75,11 0 top
SW59  177.25,11 0 top
SW60  220,11 0 top
SW61  120.25,11 0 top
SW62  201,11 0 top
SW63  91.75,11 0 top

### Tracks (layer width: path | path; a pad name or v marks a point on that pad's centre or on a via)
+3V3  (via drill 0.4, 0.5, 0.7)
  Top 0.254: v243.5,40.5 v238,40.5 | v234.5,43.75 v231.5,43.75 | 205.3,100.25 204.3,100.25 CN1.TIP | v259.5,55 v246.5,55 | v246.25,83.25 254,83.25 254.5,82.75 259.25,82.75 v259.5,83
  Top 0.406: v233.5,30 234,30 v236.25,27.75 240,27.75 v242,29.75 v246.25,29.75 259.25,29.75 v259.5,30 | v228,87 v259.5,87 | v243.5,40.5 244,41 250.5,41 254,44.5 v259.5,44.5 | v135.75,101.25 135.51,101.25 J5.2 | J5.2 v135.75,100.75 136.81,99.69 JP1.1 143.25,99.5 144,99.5 145.75,101.25 199,101.25 200.5,99.75 202.75,99.75 203,100 203.95,100 CN1.TIP | v135.75,100.25 135.51,100.25 J5.2
  Top 0.61: 205.3,100.25 205.3,100.3 207.25,102.25 v223.5,102.25 v228,102.25 v232,102.25
  Bottom 0.254: IC1.28 233.34,30.16 v233.5,30 233.84,30.34 IC1.27 | IC1.23 235.84,28.16 v236.25,27.75 | IC1.6 244.34,30.34 243.75,29.75 v242,29.75 | v242,29.75 241.84,29.91 IC1.11 | IC1.34 235.84,39.91 234.5,41.25 C16.1 | IC1.39 238.34,40.16 v238,40.5 237.75,40.5 v234.5,43.75 | IC1.51 244.34,39.66 v243.5,40.5 | C16.1 233.5,41.25 | MOD2.2 246.25,76.09 v246.25,83.25 | MOD3.2 246.25,47.59 246.25,54.75 v246.5,55 | C3.1 v242,29.75 | IC1.29 233.34,41.02 C16.1 | C16.1 233,41.35 233,42.25 v231.5,43.75 | MOD1.12 235,102.54 234.96,102.5 | R2.2 259.5,95 | R3.2 259.5,92.5 | R4.2 230.15,92.15 228.35,92.15 228,92.5
  Bottom 0.305: v259.5,87 259.5,92.5 259.5,95 259.5,96 258,97.5 R1.2 | JP3.6 223.54,102.29 v223.5,102.25
  Bottom 0.406: MOD4.2 246.25,19.09 246.25,26.25 246.5,26.5 246.5,27.5 246.25,27.75 v246.25,29.75 | v259.5,30 v259.5,44.5 v259.5,55 v259.5,83 v259.5,87
  Bottom 0.61: 234.96,102.5 232.25,102.5 v232,102.25 | v228,87 228,92.5 v228,102.25
BAR
  Bottom 0.254: SW29.CHOC1 204,70.9 204,60.5 206,58.5 225.5,58.5 228.5,55.5 228.5,41.25 233,36.75 242.25,36.75 245.34,33.66 IC1.4
D0  (via drill 0.5)
  Top 0.254: JP3.1 253.23,108.27 v253.75,107.75
  Bottom 0.305: v253.75,107.75 251.04,107.75 MOD1.1
D1  (via drill 0.5)
  Top 0.254: JP3.3 227.35,107 252.75,107 254,105.75
  Top 0.305: 254,105.75 v254,105.25
  Bottom 0.305: v254,105.25 253.83,105.08 MOD1.2
D2  (via drill 0.5)
  Top 0.254: JP3.5 224.75,107.06 224.75,104.88 225.38,104.25 252.25,104.25 v253.5,103
  Bottom 0.305: v253.5,103 253.04,102.54 MOD1.3
D3  (via drill 0.5)
  Top 0.254: JP3.7 222.25,107.02 222.25,105 223.5,103.75 250.25,103.75 v253.25,100.75
  Bottom 0.305: v253.25,100.75 252.5,100 MOD1.4
D8  (via drill 0.5)
  Top 0.254: v216,95.75 231.75,95.75 v232,95.5
  Bottom 0.254: JP3.12 215.92,95.83 v216,95.75 | v232,95.5 232.5,95 234.67,95
  Bottom 0.305: 234.67,95 MOD1.9
D9  (via drill 0.5)
  Top 0.254: v218.5,97.5 v231.25,97.5
  Bottom 0.254: JP3.10 218.46,97.54 v218.5,97.5 | v231.25,97.5 234.71,97.5
  Bottom 0.305: 234.71,97.5 MOD1.10
D10  (via drill 0.5)
  Top 0.254: v231.25,101 v221,101
  Bottom 0.254: MOD1.11 233.75,101 v231.25,101 | v221,101 JP3.8
GND  (via drill 0.4, 0.5)
  Top 0.406: v135.75,106.75 J1.2
  other vias: 238.75,30 240.25,26.75 242.5,39.75 230,42 234.5,40 135.75,107.25 135.75,106.25 232.25,31.25 140.25,1 145.25,1 150.25,1 160.25,1 155.25,1 165.25,1 170.25,1 175.25,1 180.25,1 185.25,1 190.25,1 195.25,1 200.25,1 205.25,1 210.25,1 215.25,1 220.25,1 225.25,1 230.25,1 235.25,1 240.25,1 245.25,1 250.25,1 255.25,1 260.75,5.5 260.75,10 260.75,15 260.75,20 260.75,25 260.75,28 260.75,35 260.75,40 260.75,46.5 260.75,57 260.75,50 260.75,60 260.75,65 260.75,70 260.75,75 260.75,80 260.75,85 260.75,90 260.75,95 260.75,100 260.75,105 254.75,109.25 138.5,109.5 142.25,109.5 147.25,109.5 152.25,109.5 157.25,109.5 162.25,109.5 167.25,109.5 172.25,109.5 177.25,109.5 182.25,109.5 187.25,109.5 192.25,109.5 197.25,109.5 136,96.5 136,87.25 136,82.75 136,77.75 136,72.75 156,97 136,62.75 136,57.75 136,52.75 136,42.75 136,47 136,37.75 136,32.75 136,27.75 136,22.75 136,17.75 136,12.75 136,7.75 141,97 139,103.5 139.25,101 226,99 220,99 206,97 191,97 171,97 230.5,106 232.5,106 231.5,105.25 204.75,109.5 209.25,109.5 230,99 222,96.75
  pour Bottom: 263,110.5 136,110.5 136,98 135,97 135,0 263,0
  pour Top: 263,110.5 135,110.5 135,0 263,0
GND2  (via drill 0.4, 0.5)
  Top 0.406: v133.25,107.25 133.49,107.25 J1.1 | v133.25,106.75 J1.1 | v133.25,106.25 133.49,106.25 J1.1
  Bottom 0.254: IC3.18 v17.25,106.75
  other vias: 13.75,100 8.25,97.25 26.25,106.75 23.25,98.25 1,99.5 1,94.5 1,89.5 1,84.5 1,79.5 1,74.5 1,69.5 1,64.5 1,59.5 1,54.5 1,49.5 1,44.5 1,39.5 1,34.5 1,29.5 1,24.5 1,19.5 1,14.5 1,9.5 1,4.5 4.75,1 9.75,1 14.75,1 19.75,1 24.75,1 29.75,1 34.75,1 39.75,1 44.75,1 49.75,1 54.75,1 59.75,1 64.75,1 69.75,1 74.75,1 84.75,1 79.75,1 89.75,1 94.75,1 99.75,1 104.75,1 109.75,1 114.75,1 119.75,1 124.75,1 1,104.5 7.25,108.75 10.5,107.5 15,107.5 20.25,107.5 32.25,109.5 37.25,109.5 42.25,109.5 47.25,109.5 52.25,109.5 57.25,109.5 62.25,109.5 72.25,109.5 77.25,109.5 82.25,109.5 87.25,109.5 97.25,109.5 92.25,109.5 102.25,109.5 107.25,109.5 117.25,109.5 112.25,109.5 122.25,109.5 127.25,109.5 129.25,1 133,7.75 133,12.75 133,17.75 133,22.75 133,27.75 133,32.75 133,37.75 133,42.75 133,47 133,52.75 133,57.75 133,62.75 133,72.75 133,77.75 133,82.75 133,92.75 133,87.25 132.75,96.5 131.5,101 131.5,103.5 131.5,106 131.25,108.75 83.5,102 73.5,102 58.5,102 61.75,102 7.5,103 25.5,96.5 34.5,96 43,96.5 55,96 72,96 81.5,93 86.5,96 117,95
  pour Top: 134,110.5 -0.5,110.5 -0.25,0 134,0
  pour Bottom: 133,110.5 -0.5,110.5 -0.25,0 134,0 134,97 133.25,97 133.25,97.25 133,97.25
N$1  (via drill 0.5)
  Top 0.254: v257.5,59 254.25,62.25 SW4.B | v245.25,36 252.75,36 253.75,37 v257.5,37
  Bottom 0.254: v257.5,37 257.75,37.25 257.75,38.25 257.5,38.5 v257.5,59 | IC1.53 245.34,36.09 v245.25,36
N$2
  Bottom 0.254: IC3.48 12.75,94.65 SW7.CHOC1
N$3  (via drill 0.5)
  Top 0.305: SW5.B 241.6,41.4 v241.75,41.25
  Bottom 0.254: v241.75,41.25 241.34,40.84 IC1.45
N$4  (via drill 0.5)
  Top 0.254: v12,102 28,102 29.5,100.5 29.5,93.4 SW8.CHOC1
  Bottom 0.254: IC3.9 12.75,104.75 12,104 v12,102
N$5  (via drill 0.5)
  Top 0.254: v258,88.5 254,88.5 254,91.35 SW2.B | v244.5,37 253,37 253.75,37.75 v256.75,37.75
  Bottom 0.254: v256.75,37.75 257,38 257,39 256.75,39.25 256.75,58.25 256.5,58.5 256.5,59.5 256.75,59.75 256.75,71.25 258,72.5 v258,88.5 | IC1.52 244.84,37.34 v244.5,37
N$6  (via drill 0.5)
  Top 0.254: v13,103 48,103 49,102 49,93.5 49.5,93 49.1,93 SW9.CHOC1
  Bottom 0.254: IC3.10 13.25,104.5 13,104.25 v13,103
N$7
  Bottom 0.254: SW27.CHOC1 166,70.9 166,61.25 170,57.25 225,57.25 227.5,54.75 227.5,40.75 232.5,35.75 241.75,35.75 243.84,33.66 IC1.7
N$8  (via drill 0.5)
  Top 0.254: v14,104 64,104 68,100 SW10.CHOC1
  Bottom 0.254: IC3.12 14.25,104.25 v14,104
N$9
  Bottom 0.254: IC3.25 20.75,104.5 21,104.25 86.5,104.25 94.25,96.5 110.75,96.5 115,92.25 115,83.65 124.75,73.9 SW25.CHOC1
N$10
  Bottom 0.254: IC1.21 236.84,29.16 237.5,28.5 237.5,24.5 233.5,20.5 152.35,20.5 SW58.CHOC1
N$11
  Bottom 0.254: SW18.CHOC1 223,89.9 223,80.5 231.5,72 231.5,49.5 239.84,41.16 IC1.42
N$12
  Bottom 0.254: IC3.47 13.25,89.75 14.25,88.75 14.25,63.75 23,55 29.9,55 SW32.CHOC1
N$13
  Bottom 0.254: SW49.CHOC1 114,46.9 114,91.75 110.25,95.5 93.75,95.5 86,103.25 20,103.25 19.25,104 IC3.22
N$14
  Bottom 0.254: SW44.CHOC1 29.9,36 23,36 13.75,45.25 13.75,88.5 12.25,90 9.25,90 8.75,90.5 8.75,93.5 12.25,97 IC3.49
N$15
  Bottom 0.254: IC1.8 243.34,33.41 241.5,35.25 232.25,35.25 223,44.5 223,55 221.25,56.75 151.25,56.75 146.75,61.25 146.75,71.15 SW26.CHOC1
N$16
  Bottom 0.254: IC1.37 237.34,39.16 229.5,47 229.5,70 223,76.5 152.5,76.5 147.5,81.5 147.5,89.4 SW14.CHOC1
N$17
  Bottom 0.254: SW30.CHOC1 223,70.9 223,62 229,56 229,41.5 233.25,37.25 242.5,37.25 245.84,33.91 IC1.3
N$19
  Bottom 0.254: IC3.35 19.25,95.75 22,93 22,82.25 25,79.25 32.75,79.25 34.75,77.25 67.25,77.25 70.75,73.75 70.75,24.15 63.5,16.9 SW57.CHOC1
N$20
  Bottom 0.254: SW12.CHOC1 94.85,92.9 87.75,100 58,100 55.75,102.25 19.5,102.25 18.25,103.5 IC3.20
N$21
  Bottom 0.254: SW56.CHOC1 32.25,19.4 32.25,69.75 32,70 32,73 32.25,73.25 32.25,74.5 31,75.75 22,75.75 18,79.75 18,91.75 14.75,95 IC3.44
N$22
  Bottom 0.254: SW54.CHOC1 227.1,35.9 230.75,32.25 239.5,32.25 239.84,31.91 IC1.15
N$23
  Bottom 0.254: IC3.54 9.75,97.5 6.75,94.5 6.75,88.75 7.5,88 7.5,20.4 SW55.CHOC1
N$24
  Bottom 0.254: SW42.CHOC1 222.5,52.4 222.5,44.25 232,34.75 241.25,34.75 242.84,33.16 IC1.9
N$25
  Bottom 0.254: SW24.CHOC1 105.65,74.25 99,74.25 95.25,78 95.25,91.75 87.5,99.5 57.75,99.5 55.5,101.75 19.25,101.75 17.75,103.25 IC3.19
N$26
  Bottom 0.254: SW19.CHOC1 13.25,76.15 13.25,88.25 12,89.5 9,89.5 8.25,90.25 8.25,93.75 11.75,97.25 IC3.50
N$27  (via drill 0.5)
  Top 0.254: v232,89 232,90 233,91 233,91.35 SW1.B
  Bottom 0.254: v232,89 232,49.75 240.34,41.41 IC1.43
N$28
  Bottom 0.254: IC3.45 14.25,89.5 14.75,89 14.75,82.25 23,74 29.9,74 SW20.CHOC1
N$29
  Bottom 0.254: IC1.13 240.84,32.41 240,33.25 231.25,33.25 225.5,39 175,39 165.75,48.25 165.75,52 163,54.75 SW39.CHOC1
N$30
  Bottom 0.254: SW21.CHOC1 47.9,75 34,75 31.75,77.25 22.75,77.25 19.5,80.5 19.5,92.5 16.25,95.75 IC3.41
N$31
  Bottom 0.254: IC1.19 237.84,29.66 238.5,29 238.5,24 234,19.5 203.6,19.5 SW62.CHOC1
N$32
  Bottom 0.254: SW22.CHOC1 67.9,74 68,74 65.25,76.75 34.5,76.75 32.5,78.75 24.75,78.75 21.5,82 21.5,92.75 18.75,95.5 IC3.36
N$33
  Bottom 0.254: SW40.CHOC1 185,51.9 185,47.5 193,39.5 225.75,39.5 231.5,33.75 240.25,33.75 241.34,32.66 IC1.12
N$34
  Bottom 0.254: IC3.26 21.25,105 21.5,104.75 86.75,104.75 94.5,97 111,97 115.1,92.9 SW13.CHOC1
N$35
  Bottom 0.254: SW36.CHOC1 105.9,55 99,55 94.75,59.25 94.75,91.5 87.25,99 57.5,99 55.25,101.25 19,101.25 16.75,103.5 IC3.17
N$36
  Bottom 0.254: SW35.CHOC1 86.65,55.25 82.5,55.25 78.75,59 78.75,74.25 74.25,78.75 41.25,78.75 37.25,82.75 37.25,95.75 33.75,99.25 18,99.25 14.75,102.5 IC3.13
N$37
  Bottom 0.254: IC1.16 239.34,30.41 239.5,30.25 239.5,29.5 239,29 239,23.75 234.25,19 222.1,19 SW60.CHOC1
N$38
  Bottom 0.254: SW48.CHOC1 105.9,36 99,36 94.25,40.75 94.25,91.25 87,98.5 57.25,98.5 55,100.75 18.75,100.75 16.25,103.25 IC3.16
N$39
  Bottom 0.254: SW59.CHOC1 180.35,20 233.75,20 238,24.25 238,28.75 237.34,29.41 IC1.20
N$40
  Bottom 0.254: SW38.CHOC1 147,51.9 147,47.5 156,38.5 225.25,38.5 231,32.75 239.75,32.75 240.34,32.16 IC1.14
N$41
  Bottom 0.254: SW28.CHOC1 185,70.9 185,67 194,58 225,58 228,55 228,41 232.75,36.25 242,36.25 244.84,33.41 IC1.5
N$43
  Bottom 0.254: SW23.CHOC1 86.85,73.75 80,73.75 74.5,79.25 41.5,79.25 37.75,83 37.75,96 34,99.75 18.25,99.75 15.25,102.75 IC3.14
N$44
  Bottom 0.254: SW11.CHOC1 81.9,98 57,98 54.75,100.25 18.5,100.25 15.75,103 IC3.15
N$46  (via drill 0.5)
  Top 0.254: v246.5,40 254.15,40 254.15,41.3 SW6.B'
  Bottom 0.254: v246.5,40 245.84,39.34 IC1.54
N$47
  Bottom 0.254: SW17.CHOC1 204,89.9 204,86 212,78 224.5,78 231,71.5 231,49.25 239.34,40.91 IC1.41
N$48
  Bottom 0.254: SW50.CHOC1 147,32.9 147,26.5 152.5,21 233.25,21 237,24.75 237,28.25 236.34,28.91 IC1.22
N$49
  Bottom 0.254: SW51.CHOC1 166,32.9 166,29 173.5,21.5 233,21.5 235.34,23.84 IC1.24
N$50
  Bottom 0.254: SW31.CHOC1 8.5,57.4 8.5,88.5 7.75,89.25 7.75,94 10.75,97 IC3.52
N$51
  Bottom 0.254: SW52.CHOC1 185,32.9 185,29.5 192.5,22 232.75,22 234.84,24.09 IC1.25
N$52  (via drill 0.5)
  Top 0.254: v232.75,60.5 SW3.B
  Bottom 0.254: IC1.44 240.84,41.66 232.5,50 232.5,60.25 v232.75,60.5
N$53
  Bottom 0.254: SW53.CHOC1 204,32.9 204,29 210.5,22.5 232.5,22.5 234.34,24.34 IC1.26
N$54
  Bottom 0.254: SW33.CHOC1 48.9,55 42,55 33.25,63.75 33.25,70.25 33,70.5 33,72.5 33.25,72.75 33.25,75 31.5,76.75 22.5,76.75 19,80.25 19,92.25 15.75,95.5 IC3.42
N$55
  Bottom 0.254: SW16.CHOC1 185,89.9 185,86 193.5,77.5 224,77.5 230.5,71 230.5,49 238.84,40.66 IC1.40
N$56
  Bottom 0.254: 67.65,55.25 SW34.CHOC1 67.6,54.9 65.5,57 65.5,72.75 62,76.25 34.25,76.25 32.25,78.25 23.25,78.25 20.5,81 20.5,93 18.25,95.25 IC3.37
N$57
  Bottom 0.254: IC3.33 20.25,97.25 21,96.5 21,94.75 22.5,93.25 22.5,82.5 25.25,79.75 33,79.75 35,77.75 73.75,77.75 77.75,73.75 77.75,23.75 84.5,17 91.65,17 SW63.CHOC1
N$59  (via drill 0.4)
  other vias: 133.75,89.25
N$63
  Bottom 0.254: IC1.38 237.84,39.41 230,47.25 230,70.5 223.5,77 175,77 166,86 166,89.9 SW15.CHOC1
N$64
  Bottom 0.254: SW41.CHOC1 204,51.9 204,48.5 212.5,40 226,40 231.75,34.25 241,34.25 242.34,32.91 IC1.10
N$65  (via drill 0.4)
  other vias: 133.75,88.75
N$66  (via drill 0.4)
  other vias: 133.75,88.25
N$67  (via drill 0.4)
  other vias: 135.25,89.25
N$68  (via drill 0.4)
  other vias: 135.25,88.75
N$69  (via drill 0.4)
  other vias: 135.25,88.25
N$70  (via drill 0.4)
  other vias: 133.75,68.5
N$71  (via drill 0.4)
  other vias: 133.75,68
N$72  (via drill 0.4)
  other vias: 133.75,67.5
N$73  (via drill 0.4)
  other vias: 135.25,68.5
N$74
  Bottom 0.254: IC3.53 10.25,97.25 7.25,94.25 7.25,89 8,88.25 8,38.9 SW43.CHOC1
N$75
  Bottom 0.254: SW37.CHOC1 114.5,65.4 114.5,92 110.5,96 94,96 86.25,103.75 20.5,103.75 20.25,104 IC3.24
N$76  (via drill 0.4)
  other vias: 135.25,68
N$77  (via drill 0.4)
  other vias: 135.25,67.5
N$78
  Bottom 0.254: SW45.CHOC1 48.9,36 42,36 32.75,45.25 32.75,70 32.5,70.25 32.5,72.75 32.75,73 32.75,74.75 31.25,76.25 22.25,76.25 18.5,80 18.5,92 15.25,95.25 IC3.43
N$79  (via drill 0.4)
  other vias: 133.75,49.5
N$80
  Bottom 0.254: SW46.CHOC1 67.9,36 61,36 51.75,45.25 51.75,74.25 50.25,75.75 34,75.75 32,77.75 23,77.75 20,80.75 20,92.75 17.75,95 IC3.38
N$81  (via drill 0.4)
  other vias: 133.75,49
N$82
  Bottom 0.254: SW47.CHOC1 86.65,36.25 82.5,36.25 78.25,40.5 78.25,74 74,78.25 35.25,78.25 33.25,80.25 25.75,80.25 23,83 23,93.5 21.5,95 21.5,96.75 20.75,97.5 IC3.32
N$83  (via drill 0.4)
  other vias: 133.75,48.5
N$84  (via drill 0.4)
  other vias: 135.25,49.5
N$85  (via drill 0.4)
  other vias: 135.25,49
N$86
  Bottom 0.254: IC3.21 18.75,103.75 19.75,102.75 56,102.75 58.25,100.5 88,100.5 93.5,95 110,95 113.5,91.5 113.5,22.9 119.5,16.9 SW61.CHOC1
N$87  (via drill 0.4)
  other vias: 135.25,48.5
N$88  (via drill 0.4)
  other vias: 133.75,30.5
N$89  (via drill 0.4)
  other vias: 133.75,30
N$90  (via drill 0.4)
  other vias: 133.75,29.5
N$91  (via drill 0.4)
  other vias: 135.25,30.5
N$92  (via drill 0.4)
  other vias: 135.25,30
N$93  (via drill 0.4)
  other vias: 135.25,29.5
N$94  (via drill 0.4)
  other vias: 133.75,6
N$95  (via drill 0.4)
  other vias: 133.75,5.5
N$96  (via drill 0.4)
  other vias: 133.75,5
N$97  (via drill 0.4)
  other vias: 135.25,6
N$98  (via drill 0.4)
  other vias: 135.25,5.5
N$99  (via drill 0.4)
  other vias: 135.25,5
N$100  (via drill 0.4)
  other vias: 133.75,11.5
N$101  (via drill 0.4)
  other vias: 133.75,11
N$102  (via drill 0.4)
  other vias: 133.75,10.5
N$103  (via drill 0.4)
  other vias: 135.25,11.5
N$104  (via drill 0.4)
  other vias: 135.25,11
N$105  (via drill 0.4)
  other vias: 135.25,10.5
SCL  (via drill 0.4, 0.5, 0.7)
  Top 0.254: v248,38.75 252.5,38.75 253,39.25 v255.25,39.25 | v245.5,56 v255.25,56 | v255.75,84.5 v245.25,84.5 232,84.5 231.5,84 218,84 217.5,83.5 v216.5,83.5 216,83.5 215.5,84 v208.5,84 | v208.5,104.25 204.3,104.25 CN1.RING1 200.8,104.3 198.73,102.23 JP1.2 136.27,102.23 v135.75,102.75
  Top 0.406: v135.75,103.25 135.51,103.25 J3.2 | v135.75,102.75 J3.2 | v135.75,102.25 135.51,102.25 J3.2
  Bottom 0.254: MOD2.3 245.5,76.84 245.5,82 245.25,82.25 v245.25,84.5 | MOD3.3 245.5,48.34 v245.5,56 | IC1.2 246.34,31.84 248,33.5 v248,38.75 | v255.25,39.25 v255.25,56 255.25,56.5 255,56.75 255,57.75 255.25,58 255.25,71.75 256,72.5 256,84.25 v255.75,84.5 | v208.5,104.25 v208.5,84 | v245.25,84.5 245.5,84.5 | v245.25,84.5 246.5,85.75 246.5,92.5 249,95 251,95 | 215.92,108.17 214.75,107 214.75,94.75 216.25,93.25 216.25,83.75
  Bottom 0.305: JP3.11 215.92,108.17 | 216.25,83.75 v216.5,83.5
  Bottom 0.406: R2.1 251,95 MOD1.6
SCL2  (via drill 0.5)
  Top 0.254: v245.5,27 v253.5,27 | v237.5,83.75 245.5,83.75 245.75,84 246.75,84 247,83.75 v255,83.75 | v230,95 229.75,95.25 216.75,95.25 216.5,95 215.5,95 215.25,95.25 v211.75,95.25
  Bottom 0.254: MOD4.3 245.5,19.84 v245.5,27 | v253.5,27 254.5,28 254.5,38.5 254.25,38.75 254.25,39.75 254.5,40 254.5,55.25 254.25,55.5 254.25,56.5 254.5,56.75 254.5,72 255,72.5 v255,83.75 | v237.5,83.75 237.25,83.75 237.25,89.88 MOD1.8 234.62,92.25 R4.1 231.85,93.4 230.25,95 v230,95 | v211.75,95.25 211.75,106.64 JP3.13
SCL'  (via drill 0.4, 0.5)
  Top 0.254: CN2.RING1 70.2,104.3 70.2,105.55 69.25,106.5 67,106.5 v66.75,106.25 | JP2.3 132.73,102.23 v133.25,102.75
  Top 0.406: v133.25,103.25 133.49,103.25 J3.1 | v133.25,102.75 J3.1 | v133.25,102.25 133.49,102.25 J3.1
  Bottom 0.254: IC3.2 9.25,108 9.75,108.5 29.75,108.5 32,106.25 64.25,106.25 64.5,106 66.5,106 v66.75,106.25 67,106.5 69.25,106.5 70,105.75 87.5,105.75 95.25,98 120.5,98 124.73,102.23 JP2.3
SDA  (via drill 0.4, 0.5, 0.7)
  Top 0.254: v248.75,37.75 252.75,37.75 253.5,38.5 v256,38.5 | v244.5,56.75 245,57.25 v256,57.25 | v256.75,85.5 v244.5,85.5 231.5,85.5 230.5,84.5 218.5,84.5 218,85 v217.5,85 216.5,85 216,84.5 210.5,84.5 v210,85 | 204.95,107.25 v210,107.25 | CN1.RING2 204.2,107.25 202.75,107.25 198.25,102.75 145.75,102.75 143.75,104.75 143.08,104.75 JP1.3 135.77,104.77 v135.75,104.75
  Top 0.406: v135.75,105.25 135.51,105.25 J2.2 | v135.75,104.75 J2.2 | v135.75,104.25 135.51,104.25 J2.2 | 204.95,107.25 204.3,107.25 CN1.RING2
  Bottom 0.254: MOD2.4 242.87,76.75 243.5,76.75 244.75,78 244.75,83.75 244.5,84 v244.5,85.5 246,87 246,94.5 248.96,97.46 MOD1.5 | MOD3.4 244.75,50.13 244.75,55.5 244.5,55.75 v244.5,56.75 | IC1.1 246.84,31.59 248.75,33.5 v248.75,37.75 | v256,38.5 256.25,38.75 256.25,39.75 256,40 256,55.25 256.25,55.5 256.25,56.5 256,56.75 v256,57.25 256,71.5 257,72.5 257,85.25 v256.75,85.5 | v210,107.25 v210,85 | JP3.9 217.25,107.06 217.25,85.25
  Bottom 0.305: 217.25,85.25 v217.5,85
  Bottom 0.406: R1.1 250.96,97.5 MOD1.5
SDA2  (via drill 0.5)
  Top 0.254: v245,28 v253,28 | v213.25,94.5 216.75,94.5 217,94.75 228.75,94.75 229.5,94 254.75,94 v255,93.75
  Bottom 0.254: MOD4.4 242.62,19.5 243.25,19.5 244.75,21 244.75,26.5 244.5,26.75 244.5,27.5 v245,28 | v253,28 254,29 254,38.25 253.75,38.5 253.75,40 254,40.25 254,54.75 253.5,55.25 253.5,56.75 254,57.25 254,92 254.15,92.15 R3.1 254.03,92.38 253.77,92.38 | JP3.14 213.38,94.63 v213.25,94.5
  Bottom 0.305: R3.1 254.15,92.9 v255,93.75
  Bottom 0.406: R3.1 251.03,92.5 MOD1.7
SDA'  (via drill 0.4, 0.5)
  Top 0.254: v65.25,106.75 66,107.5 71.05,107.5 CN2.RING2 71.3,107.25 v73.3,107.25 | JP2.2 133.23,104.77 v133.25,104.75
  Top 0.406: v133.25,105.25 133.49,105.25 J2.1 | v133.25,104.75 J2.1 | v133.25,104.25 133.49,104.25 J2.1
  Bottom 0.254: v65.25,106.75 32.25,106.75 30,109 9.5,109 8.75,108.25 IC3.1 | JP2.2 125.02,104.77 118.75,98.5 95.5,98.5 87.75,106.25 74.75,106.25 73.75,107.25 v73.3,107.25
VCC/2  (via drill 0.4, 0.5, 0.5 pad 0.25)
  Top 0.254: CN2.TIP 71.25,101.25 68.5,104 v68.5,105.5 | v17,97 18,96 v20.25,96
  Top 0.406: v133.25,101.25 133.49,101.25 J5.1 | J5.1 v133.25,100.75 132.19,99.69 JP2.4 | v133.25,100.25 133.49,100.25 J5.1
  Bottom 0.254: IC3.34 19.75,96.5 v20.25,96 | v68.5,105.5 22.35,105.5 IC3.28 22.25,106.25 22,106.5 | 21.75,106.5 IC3.27 | 13.75,106.5 11.25,106.5 IC3.6 11.25,103.25 10.75,102.75 10.75,101 | 13.75,106.5 16,106.5 17,107.5 17.5,107.5 18.5,106.5 19.75,106.5 | 19.75,106.5 21.75,106.5 | 21.75,106.5 22,106.5 | IC3.23 19.75,106.5 | IC3.11 13.75,106.5 | v17,97 17.25,97.25 IC3.39 17.25,99.25 15.5,101 11,101 | IC3.51 11.25,100.75 11,101 | 11,101 10.75,101 | 10.75,101 8.94,101 C22.1 | 22,106.5 22.07,106.5 C17.1
  Bottom 0.406: JP2.4 124.44,99.69 122.25,97.5 94.75,97.5 87,105.25 69.25,105.25 69,105.5 v68.5,105.5
VIN
  Bottom 0.305: MOD1.14 230.51,107.62 JP3.2

### Text on the board
Unrouted: Pads should / be longer
tPlace: VOIDSTAR | 7 | 1 | If the project is half done, / just delete the other half. / Now your project is done. | 8 | LAB | 14 | MI | RAGE | BOARD | Let your left hand turn away | what your right hand attracts | BOARDS BY | NEXTPCB | (c) 2021 Voidstar Lab
bPlace: (c) 2021 Voidstar Lab LLC / LEFT HAND PROTOTYPE / v1 PRINTING A | NEXTPCB | BOARDS BY | THREE HALVES A CYBER | DECK | ONE HALF IS A MACRO PAD AND | KEYBOARD | MIRAG | NEXTPCB | IN PARTNERSHIP / WITH | proudly presents the | ZACK FREEDMAN of VOIDSTAR LAB | (c) 2021 Voidstar Lab / RIGHT HAND PROTOTYPE / v1 PRINTING A
Reference: CHOC SPACING SHOULD / BE 18x17 NOT 19x19 | 9x MILLED SLOTS / 1mm WIDE